# EAGLE schematic BTN_1_1 (EAGLE 8.3.2)
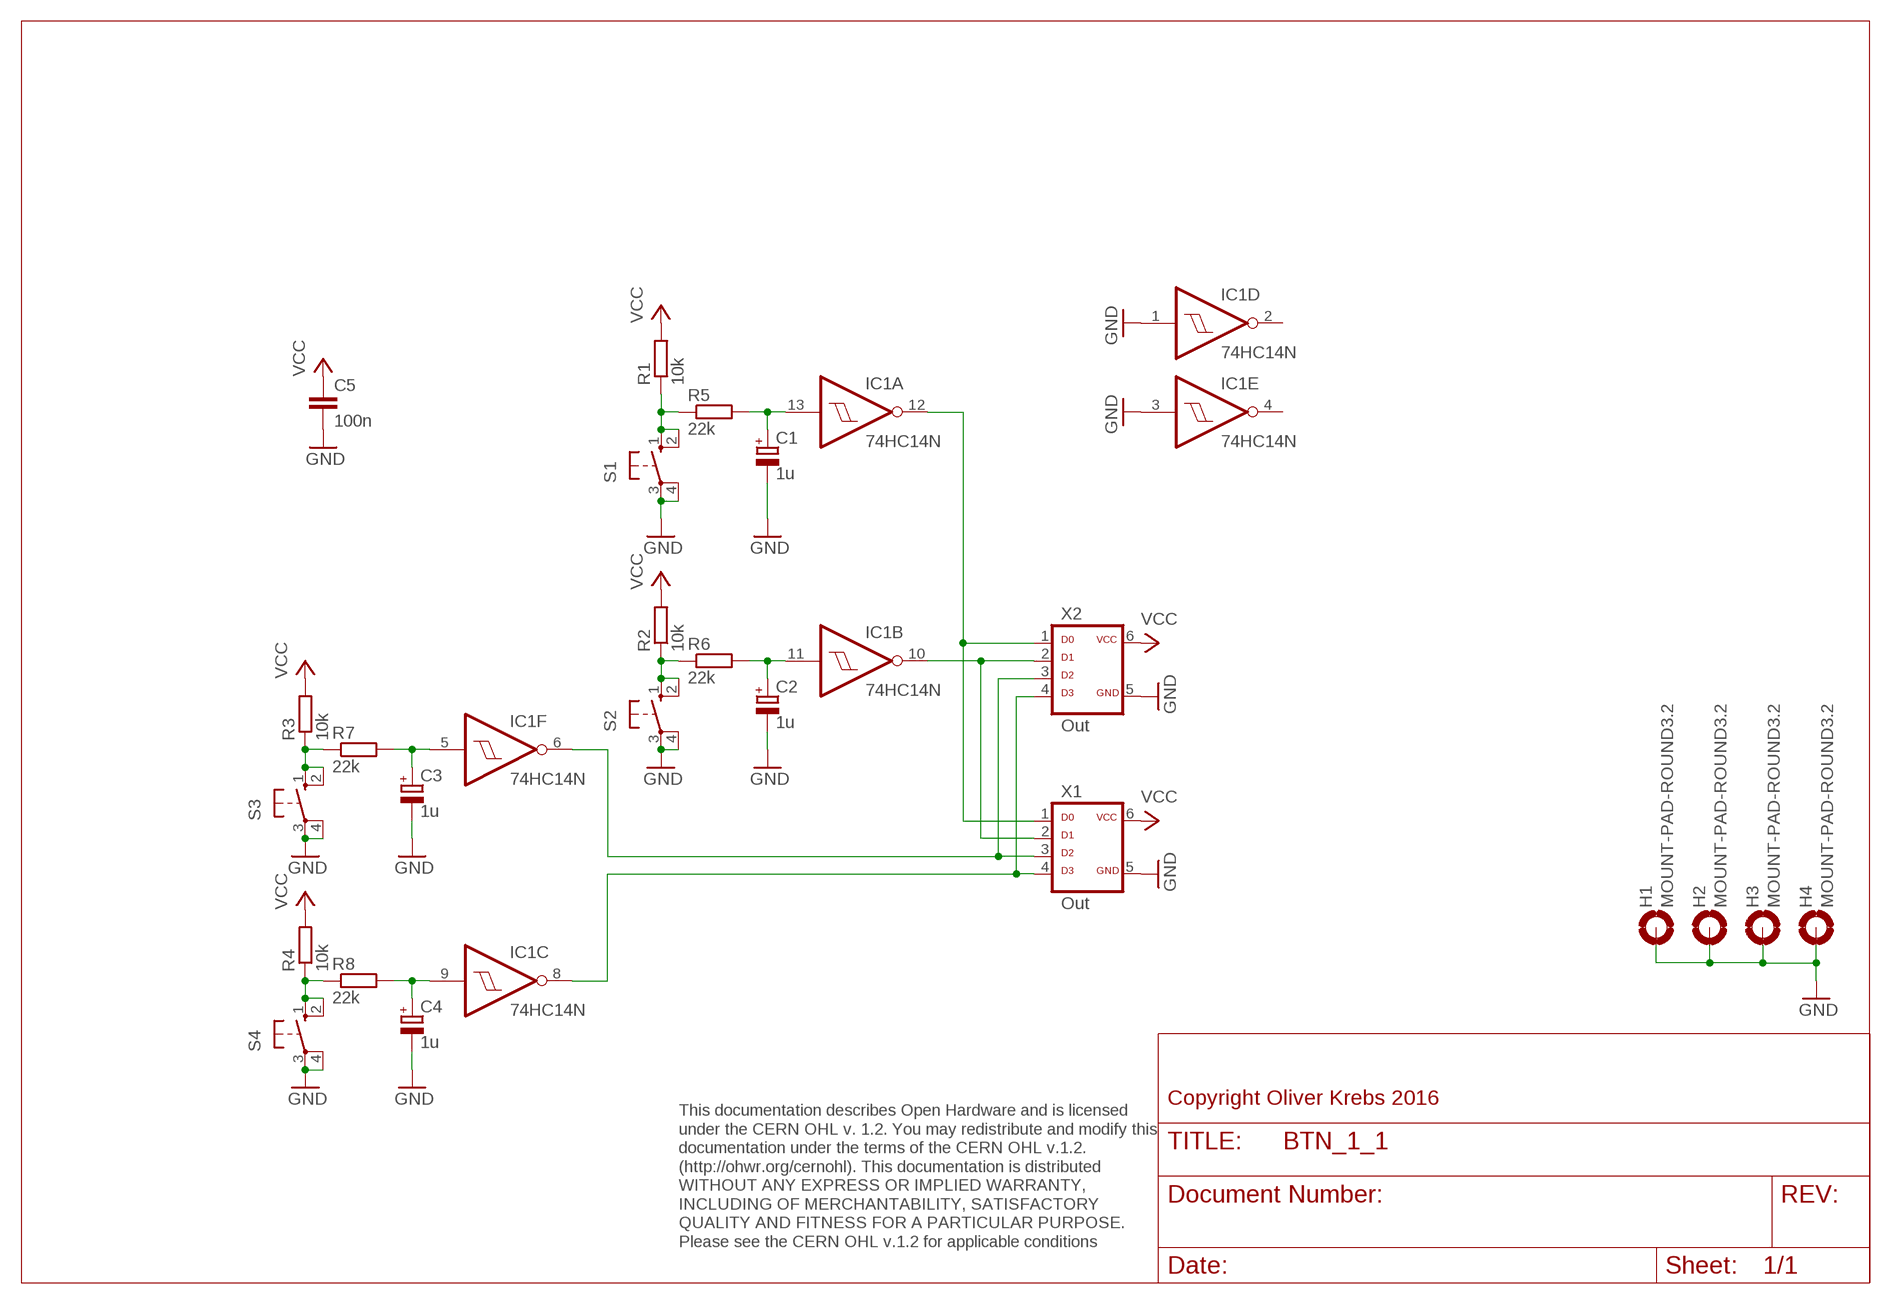
[diagram p0: schematic, sheet 1]

## Parts
C1  1u  CPOL-EUE2-5  [E2-5]
C2  1u  CPOL-EUE2-5  [E2-5]
C3  1u  CPOL-EUE2-5  [E2-5]
C4  1u  CPOL-EUE2-5  [E2-5]
C5  100n  C-EU050-025X075  [C050-025X075]
H1  MOUNT-PAD-ROUND3.2  [3,2-PAD]
H2  MOUNT-PAD-ROUND3.2  [3,2-PAD]
H3  MOUNT-PAD-ROUND3.2  [3,2-PAD]
H4  MOUNT-PAD-ROUND3.2  [3,2-PAD]
IC1  74HC14N  [DIL14]
R1  10k  R-EU_0207/10  [0207/10]
R2  10k  R-EU_0207/10  [0207/10]
R3  10k  R-EU_0207/10  [0207/10]
R4  10k  R-EU_0207/10  [0207/10]
R5  22k  R-EU_0207/10  [0207/10]
R6  22k  R-EU_0207/10  [0207/10]
R7  22k  R-EU_0207/10  [0207/10]
R8  22k  R-EU_0207/10  [0207/10]
S1  10-XX  [B3F-10XX]
S2  10-XX  [B3F-10XX]
S3  10-XX  [B3F-10XX]
S4  10-XX  [B3F-10XX]
X1  Out  ML6D  [ML-6]
X2  Out  ML6D  [ML-6]

## Nets
GND: C1.- C2.- C3.- C4.- C5.2 H1.B3,2(MOUNT) H2.B3,2(MOUNT) H3.B3,2(MOUNT) H4.B3,2(MOUNT) IC1.1(D:I) IC1.3(E:I) S1.3(P) S1.4(P1) S2.3(P) S2.4(P1) S3.3(P) S3.4(P1) S4.3(P) S4.4(P1) X1.5 X2.5
N$1: IC1.12(A:O) X1.1 X2.1
N$2: IC1.10(B:O) X1.2 X2.2
N$3: IC1.6(F:O) X1.3 X2.3
N$4: R3.1 R7.1 S3.1(S) S3.2(S1)
N$5: C3.+ IC1.5(F:I) R7.2
N$6: IC1.8(C:O) X1.4 X2.4
N$9: R4.1 R8.1 S4.1(S) S4.2(S1)
N$10: C4.+ IC1.9(C:I) R8.2
N$16: R2.1 R6.1 S2.1(S) S2.2(S1)
N$20: C2.+ IC1.11(B:I) R6.2
N$24: R1.1 R5.1 S1.1(S) S1.2(S1)
N$25: C1.+ IC1.13(A:I) R5.2
VCC: C5.1 R1.2 R2.2 R3.2 R4.2 X1.6 X2.6
Unconnected: IC1.2(D:O) IC1.4(E:O)

## Notes on the sheet
- Copyright Oliver Krebs 2016
- This documentation describes Open Hardware and is licensed 
  under the CERN OHL v. 1.2. You may redistribute and modify this 
  documentation under the terms of the CERN OHL v.1.2. 
  (http://ohwr.org/cernohl). This documentation is distributed
  WITHOUT ANY EXPRESS OR IMPLIED WARRANTY, 
  INCLUDING OF MERCHANTABILITY, SATISFACTORY 
  QUALITY AND FITNESS FOR A PARTICULAR PURPOSE. 
  Please see the CERN OHL v.1.2 for applicable conditions

## Power pins joined to a net without a drawn wire
GND: IC1.7(P:GND)
VCC: IC1.14(P:VCC)

## Library data of the parts
C1-C4 = resistor:CPOL-EU: POLARIZED CAPACITOR, European symbol
C5 = 01-my_rcl:C-EU: CAPACITOR, European symbol
H1-H4 = holes:MOUNT-PAD-ROUND: MOUNTING PAD, round
IC1 = 74xx-eu:74*14: Hex schmitt trigger INVERTER
R1-R8 = 01-my_rcl:R-EU_: RESISTOR, European symbol
S1-S4 = switch-omron:10-XX: OMRON SWITCH; MPN: B3F-1000; OC_FARNELL: 176432; OC_NEWARK: 36M3542
X1 X2 = 01-my-con:ML6D